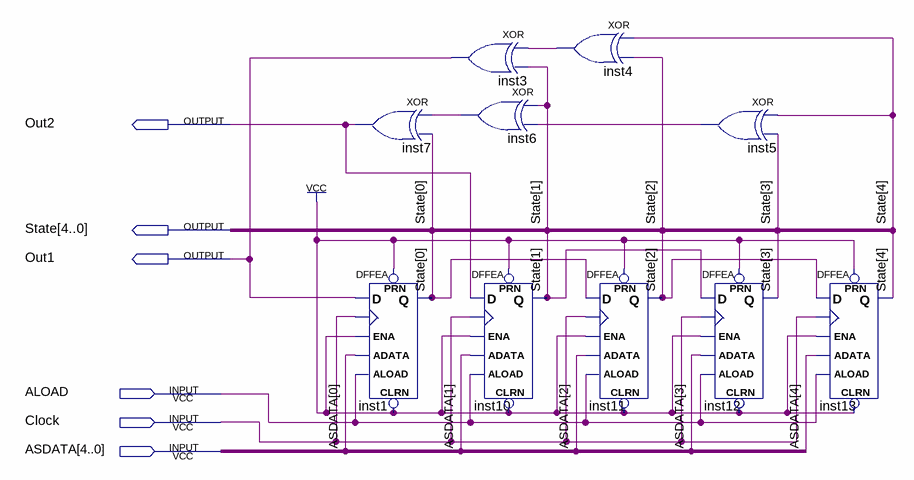
[diagram p0: schematic sheet]
// Quartus schematic MultiChannelMGenerator.bdf as structural Verilog: 10 symbols, 6 pins
module MultiChannelMGenerator (
  input  ALOAD,
  input  Clock,
  input  [4:0] ASDATA,
  output Out2,
  output [4:0] State,
  output Out1
);

  wire inst4_out, inst5_out, inst6_out;

  xor inst7 (Out2, inst6_out, State[0]);
  DFFEA inst1 (
    .PRN(1'b1), .ALOAD(ALOAD), .ADATA(ASDATA[0]), .ENA(1'b1), .CLK(Clock), .D(Out1), .CLRN(1'b1), .Q(State[0]));
  xor inst3 (Out1, inst4_out, State[1]);
  xor inst6 (inst6_out, State[1], inst5_out);
  DFFEA inst10 (
    .PRN(1'b1), .ALOAD(ALOAD), .ADATA(ASDATA[1]), .ENA(1'b1), .CLK(Clock), .D(Out2), .CLRN(1'b1), .Q(State[1]));
  xor inst4 (inst4_out, State[4], State[2]);
  DFFEA inst11 (
    .PRN(1'b1), .ALOAD(ALOAD), .ADATA(ASDATA[2]), .ENA(1'b1), .CLK(Clock), .D(State[0]), .CLRN(1'b1),
    .Q(State[2]));
  xor inst5 (inst5_out, State[4], State[3]);
  DFFEA inst12 (
    .PRN(1'b1), .ALOAD(ALOAD), .ADATA(ASDATA[3]), .ENA(1'b1), .CLK(Clock), .D(State[1]), .CLRN(1'b1),
    .Q(State[3]));
  DFFEA inst13 (
    .PRN(1'b1), .ALOAD(ALOAD), .ADATA(ASDATA[4]), .ENA(1'b1), .CLK(Clock), .D(State[2]), .CLRN(1'b1),
    .Q(State[4]));
endmodule
